# EAGLE design Shruti-FrontPanel-v01 (EAGLE 5.06)
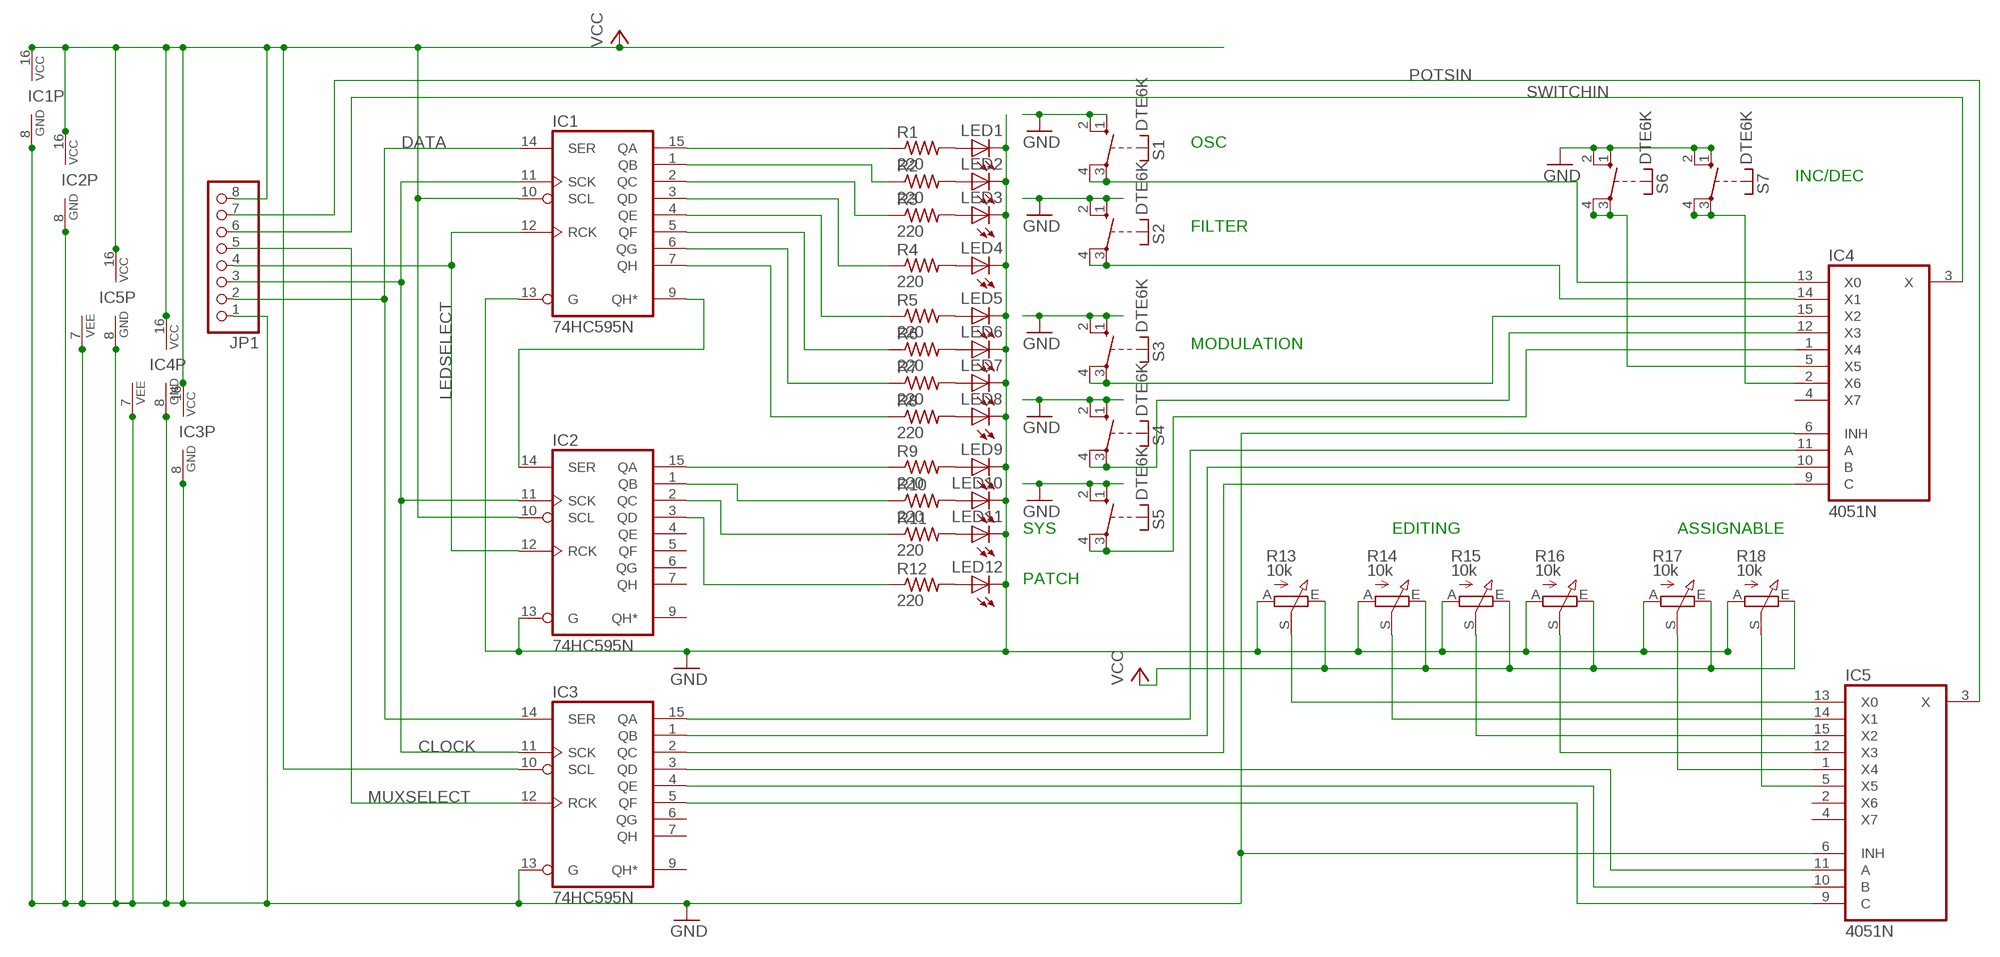
[diagram p0: schematic, sheet 1]

## Parts
IC1  74HC595N  [DIL16]
IC2  74HC595N  [DIL16]
IC3  74HC595N  [DIL16]
IC4  4051N  [DIL16]
IC5  4051N  [DIL16]
JP1  PINHD-1X8  [1X08]
LED1  LED3MM  [LED3MM]
LED2  LED3MM  [LED3MM]
LED3  LED3MM  [LED3MM]
LED4  LED3MM  [LED3MM]
LED5  LED3MM  [LED3MM]
LED6  LED3MM  [LED3MM]
LED7  LED3MM  [LED3MM]
LED8  LED3MM  [LED3MM]
LED9  LED3MM  [LED3MM]
LED10  LED3MM  [LED3MM]
LED11  LED3MM  [LED3MM]
LED12  LED3MM  [LED3MM]
R1  220  R-US_0309/12  [0309/12]
R2  220  R-US_0309/12  [0309/12]
R3  220  R-US_0309/12  [0309/12]
R4  220  R-US_0309/12  [0309/12]
R5  220  R-US_0309/12  [0309/12]
R6  220  R-US_0309/12  [0309/12]
R7  220  R-US_0309/12  [0309/12]
R8  220  R-US_0309/12  [0309/12]
R9  220  R-US_0309/12  [0309/12]
R10  220  R-US_0309/12  [0309/12]
R11  220  R-US_0309/12  [0309/12]
R12  220  R-US_0309/12  [0309/12]
R13  10k  POT_EUCABLED  [CABLE_POT_6MM]
R14  10k  POT_EUCABLED  [CABLE_POT_6MM]
R15  10k  POT_EUCABLED  [CABLE_POT_6MM]
R16  10k  POT_EUCABLED  [CABLE_POT_6MM]
R17  10k  POT_EUCABLED  [CABLE_POT_6MM]
R18  10k  POT_EUCABLED  [CABLE_POT_6MM]
S1  DTE6K  [DTE6K]
S2  DTE6K  [DTE6K]
S3  DTE6K  [DTE6K]
S4  DTE6K  [DTE6K]
S5  DTE6K  [DTE6K]
S6  DTE6K  [DTE6K]
S7  DTE6K  [DTE6K]

## Nets
CLOCK: IC1.11(SCK) IC2.11(SCK) IC3.11(SCK) JP1.3
DATA: IC1.14(SER) IC3.14(SER) JP1.2
GND: IC1.8(GND) IC1.13(G) IC2.8(GND) IC2.13(G) IC3.8(GND) IC3.13(G) IC4.6(INH) IC4.7(VEE) IC4.8(GND) IC5.6(INH) IC5.7(VEE) IC5.8(GND) JP1.1 LED1.K(C) LED2.K(C) LED3.K(C) LED4.K(C) LED5.K(C) LED6.K(C) LED7.K(C) LED8.K(C) LED9.K(C) LED10.K(C) LED11.K(C) LED12.K(C) R13.A R14.A R15.A R16.A R17.A R18.A S1.1(S) S1.2(S) S2.1(S) S2.2(S) S3.1(S) S3.2(S) S4.1(S) S4.2(S) S5.1(S) S5.2(S) S6.1(S) S6.2(S) S7.1(S) S7.2(S)
LEDSELECT: IC1.12(RCK) IC2.12(RCK) JP1.4
MUXSELECT: IC3.12(RCK) JP1.5
N$1: IC1.9(QH*) IC2.14(SER)
N$2: LED1.A R1.2
N$3: LED2.A R2.2
N$4: LED3.A R3.2
N$5: LED4.A R4.2
N$6: LED5.A R5.2
N$7: LED6.A R6.2
N$8: LED7.A R7.2
N$9: LED9.A R9.2
N$10: LED10.A R10.2
N$11: LED11.A R11.2
N$12: LED12.A R12.2
N$13: IC1.15(QA) R1.1
N$14: IC1.1(QB) R2.1
N$15: IC1.2(QC) R3.1
N$16: IC1.3(QD) R4.1
N$17: IC1.4(QE) R5.1
N$18: IC1.5(QF) R6.1
N$19: IC1.6(QG) R7.1
N$20: IC1.7(QH) R8.1
N$21: LED8.A R8.2
N$22: IC2.15(QA) R9.1
N$23: IC2.1(QB) R10.1
N$24: IC2.2(QC) R11.1
N$25: IC3.15(QA) IC4.11(A)
N$26: IC3.1(QB) IC4.10(B)
N$27: IC2.3(QD) R12.1
N$28: IC5.1(X4) R17.S
N$29: IC5.5(X5) R18.S
N$31: IC3.2(QC) IC4.9(C)
N$32: IC3.3(QD) IC5.11(A)
N$33: IC3.4(QE) IC5.10(B)
N$34: IC3.5(QF) IC5.9(C)
N$35: IC5.13(X0) R13.S
N$36: IC4.5(X5) S6.3(P) S6.4(P)
N$37: IC5.14(X1) R14.S
N$38: IC5.15(X2) R15.S
N$39: IC5.12(X3) R16.S
N$40: IC4.2(X6) S7.3(P) S7.4(P)
N$41: IC4.13(X0) S1.3(P) S1.4(P)
N$42: IC4.14(X1) S2.3(P) S2.4(P)
N$43: IC4.15(X2) S3.3(P) S3.4(P)
N$44: IC4.12(X3) S4.3(P) S4.4(P)
N$45: IC4.1(X4) S5.3(P) S5.4(P)
POTSIN: IC5.3(X) JP1.7
SWITCHIN: IC4.3(X) JP1.6
VCC: IC1.10(SCL) IC1.16(VCC) IC2.10(SCL) IC2.16(VCC) IC3.10(SCL) IC3.16(VCC) IC4.16(VCC) IC5.16(VCC) JP1.8 R13.E R14.E R15.E R16.E R17.E R18.E
Unconnected: IC2.4(QE) IC2.5(QF) IC2.6(QG) IC2.7(QH) IC2.9(QH*) IC3.6(QG) IC3.7(QH) IC3.9(QH*) IC4.4(X7) IC5.2(X6) IC5.4(X7)

## Notes on the sheet
- OSC
- INC/DEC
- FILTER
- MODULATION
- SYS | EDITING | ASSIGNABLE
- PATCH

## Library data of the parts
IC1-IC3 = 74xx-eu:74*595: 8-bit SHIFT REGISTER, output latch
IC4 IC5 = 40xx:4051: 8-channel ANALOG MULTIPLEXER
JP1 = pinhead:PINHD-1X8: PIN HEADER
LED1-LED12 = led:LED: LED OSRAM: - CHIPLED LG R971, LG N971, LY N971, LG Q971, LY Q971, LO R971, LY R971 LH N974, LH R974 LS Q976, LO Q976, LY Q976 LO Q996 - Hyper CHIPLED LW Q18S LB Q993, LB Q99A, LB R99A - SideLED LS A670, LO A670, LY A670, LG A670, LP A670 LB A673, LV A673, LT A673, LW A673 LH A674 LY A675 LS A676, LA A676, LO A676, LY A676, LW A676 LS A679, LY A679, LG A679 - Hyper Micro SIDELED® LS Y876, LA Y876, LO Y876, LY Y876 LT Y87S - SmartLED LW L88C, LW L88S LB L89C, LB L89S, LG L890 LS L89K, LO L89K, LY L89K LS L896, LA L896, LO L896, LY L896 - TOPLED LS T670, LO T670, LY T670, LG T670, LP T670 LSG T670, LSP T670, LSY T670, LOP T670, LYG T670 LG T671, LOG T671, LSG T671 LB T673, LV T673, LT T673, LW T673 LH T674 LS T676, LA T676, LO T676, LY T676, LB T676, LH T676, LSB T676, LW T676 LB T67C, LV T67C, LT T67C, LS T67K, LO T67K, LY T67K, LW E67C LS E67B, LA E67B, LO E67B, LY E67B, LB E67C, LV E67C, LT E67C LW T67C LS T679, LY T679, LG T679 LS T770, LO T770, LY T770, LG T770, LP T770 LB T773, LV T773, LT T773, LW T773 LH T774 LS E675, LA E675, LY E675, LS T675 LS T776, LA T776, LO T776, LY T776, LB T776 LHGB T686 LT T68C, LB T68C - Hyper Mini TOPLED® LB M676 - Mini TOPLED Santana® LG M470 LS M47K, LO M47K, LY M47K Source: http://www.osram.convergy.de LUXEON: - LUMILED® LXK2-PW12-R00, LXK2-PW12-S00, LXK2-PW14-U00, LXK2-PW14-V00 LXK2-PM12-R00, LXK2-PM12-S00, LXK2-PM14-U00 LXK2-PE12-Q00, LXK2-PE12-R00, LXK2-PE12-S00, LXK2-PE14-T00, LXK2-PE14-U00 LXK2-PB12-K00, LXK2-PB12-L00, LXK2-PB12-M00, LXK2-PB14-N00, LXK2-PB14-P00, LXK2-PB14-Q00 LXK2-PR12-L00, LXK2-PR12-M00, LXK2-PR14-Q00, LXK2-PR14-R00 LXK2-PD12-Q00, LXK2-PD12-R00, LXK2-PD12-S00 LXK2-PH12-R00, LXK2-PH12-S00 LXK2-PL12-P00, LXK2-PL12-Q00, LXK2-PL12-R00 Source: www.luxeon.com KINGBRIGHT: KA-3528ASYC Source: www.kingbright.com
R1-R12 = resistor:R-US_: RESISTOR, American symbol
R13-R18 = pot-cable:POT_EU
S1-S7 = switch-misc:DT: ITT SWITCH

## Board
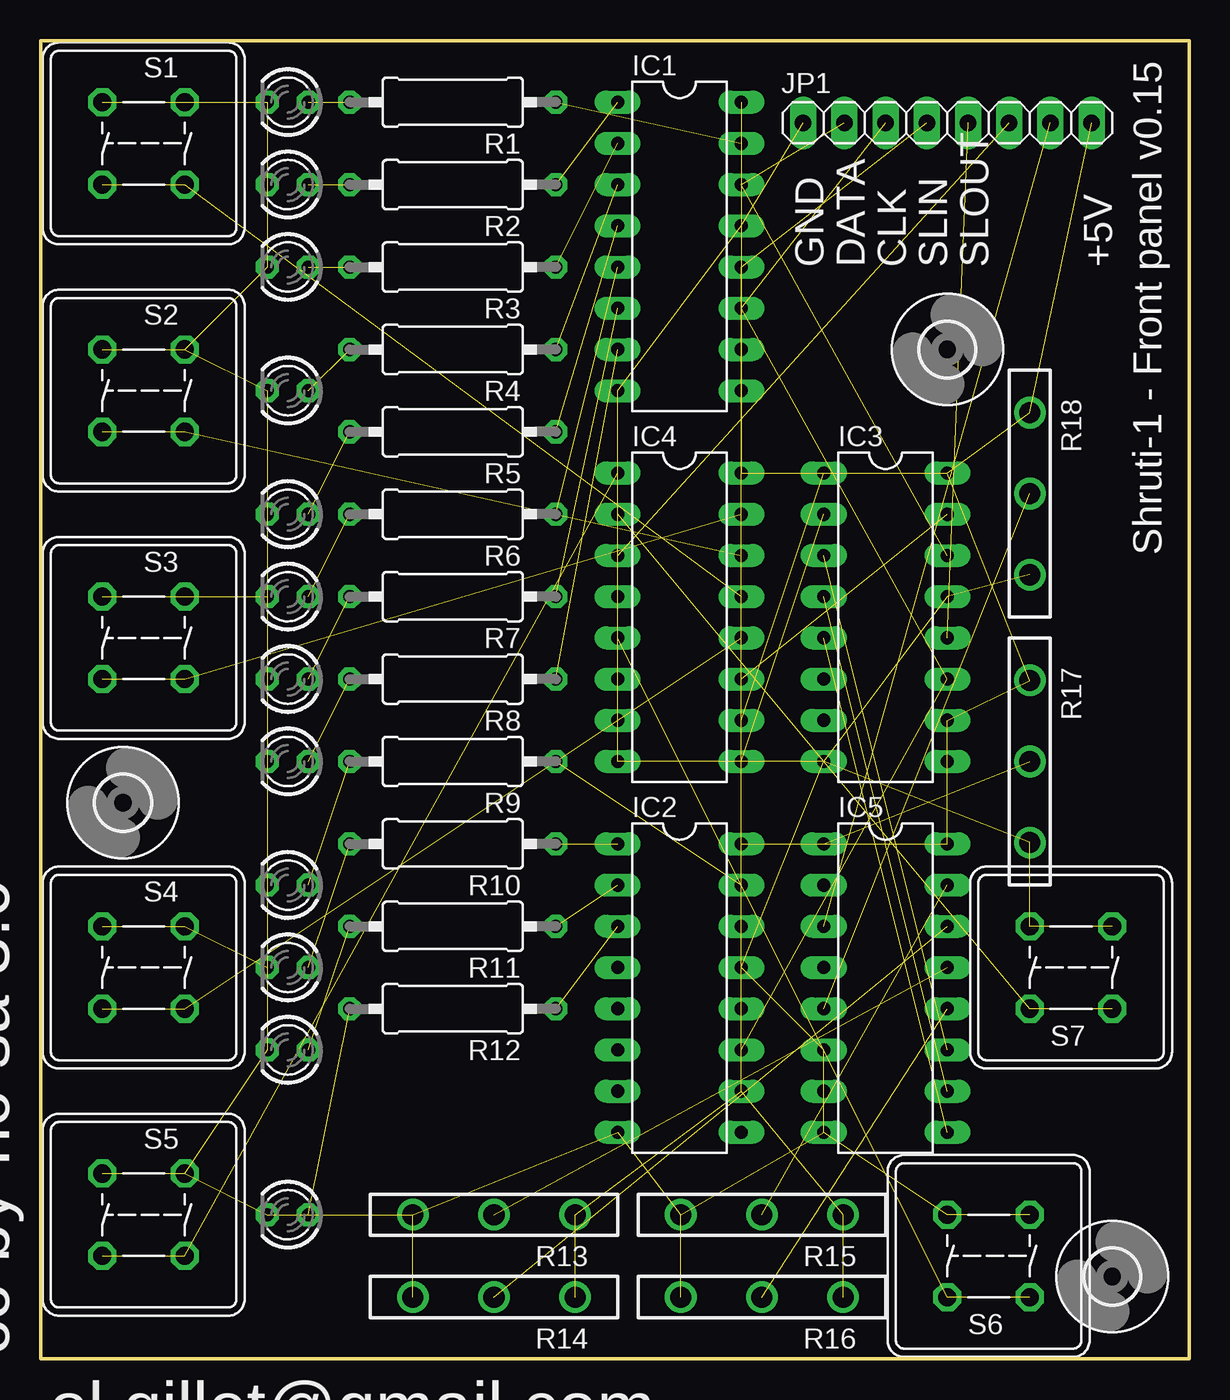
[diagram p1: board, top side]
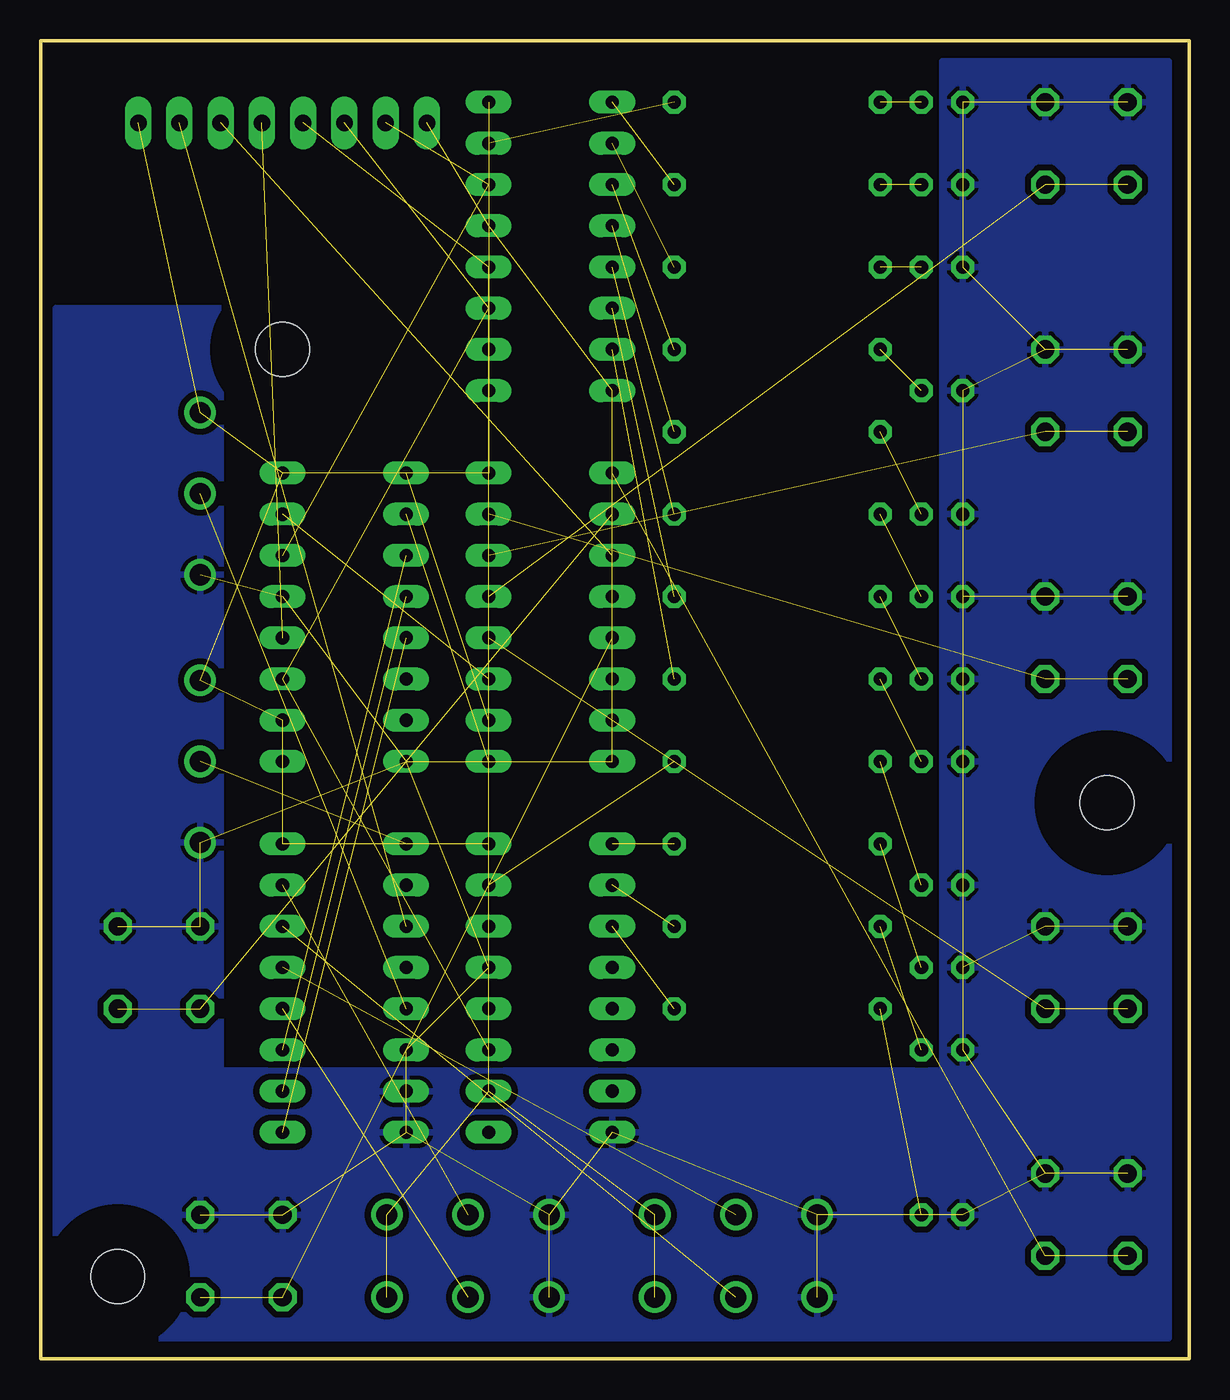
[diagram p2: board, bottom side, seen from below]

Size 70.79 x 81.27 mm. Coordinates in mm from the lower left corner, seen from the top.
Outline: 70.79,0 70.79,81.27 0,81.27 0,0 70.79,0
Copper layers (1*16): Top 0.035mm / dielectric 1.5mm / Bottom 0.035mm
Design rules "SparkFun_10mil *": minimum track width 10mil, minimum drill 20mil, track to track 10mil, track to pad 10mil, pad to pad 10mil, via to via 10mil, smd to smd 10mil, copper to edge 10mil, drill to drill 10mil, minimum pad ring 12mil, minimum via ring 10mil, stop-mask expansion 4mil, vias tented up to drill 25mil, thermal gap 10mil

### Footprints (pad centres in the part's own frame; a part is rotated, then mirrored left to right if it is on the bottom)
DIL16 = drill 0.813 long: 1 -8.89,-3.81; 2 -6.35,-3.81; 3 -3.81,-3.81; 4 -1.27,-3.81; 5 1.27,-3.81; 6 3.81,-3.81; 7 6.35,-3.81; 8 8.89,-3.81; 9 8.89,3.81; 10 6.35,3.81; 11 3.81,3.81; 12 1.27,3.81; 13 -1.27,3.81; 14 -3.81,3.81; 15 -6.35,3.81; 16 -8.89,3.81
1X08 = drill 1.016 long: 1 -8.89,0; 2 -6.35,0; 3 -3.81,0; 4 -1.27,0; 5 1.27,0; 6 3.81,0; 7 6.35,0; 8 8.89,0
LED3MM = drill 0.813 octagon: A -1.27,0; K 1.27,0
0309/12 = drill 0.813 octagon: 1 -6.35,0; 2 6.35,0
CABLE_POT_6MM = drill 1.3 pad 1.93 round: A -5,0; E 5,0; S 0,0
DTE6K = drill 1.118 octagon: 1 -2.54,2.54; 2 2.54,2.54; 3 2.54,-2.54; 4 -2.54,-2.54
3,3 = hole 3.3: 0,0

### Placement (x,y rotation side)
IC1  39.37,68.58 270 top
IC2  39.37,22.86 270 top
IC3  52.07,45.72 270 top
IC4  39.37,45.72 270 top
IC5  52.07,22.86 270 top
JP1  55.88,76.2 0 top
LED1  15.24,77.47 180 top
LED2  15.24,72.39 180 top
LED3  15.24,67.31 180 top
LED4  15.24,59.69 180 top
LED5  15.24,52.07 180 top
LED6  15.24,46.99 180 top
LED7  15.24,41.91 180 top
LED8  15.24,36.83 180 top
LED9  15.24,29.21 180 top
LED10  15.24,24.13 180 top
LED11  15.24,19.05 180 top
LED12  15.24,8.89 180 top
R1  25.4,77.47 180 top
R2  25.4,72.39 180 top
R3  25.4,67.31 180 top
R4  25.4,62.23 180 top
R5  25.4,57.15 180 top
R6  25.4,52.07 180 top
R7  25.4,46.99 180 top
R8  25.4,41.91 180 top
R9  25.4,36.83 180 top
R10  25.4,31.75 180 top
R11  25.4,26.67 180 top
R12  25.4,21.59 180 top
R13  27.94,8.89 0 top
R14  27.94,3.81 0 top
R15  44.45,8.89 0 top
R16  44.45,3.81 0 top
R17  60.96,36.83 90 top
R18  60.96,53.34 90 top
S1  6.35,74.93 0 top
S2  6.35,59.69 0 top
S3  6.35,44.45 0 top
S4  6.35,24.13 0 top
S5  6.35,8.89 0 top
S6  58.42,6.35 0 top
S7  63.5,24.13 0 top
U$1  [3,3]  5.08,34.29 0 top
U$2  [3,3]  66.04,5.08 0 top
U$3  [3,3]  55.88,62.23 0 top

### Tracks (layer width: path | path; a pad name or v marks a point on that pad's centre or on a via)
CLOCK  (3 unrouted)
DATA  (2 unrouted)
GND  (44 unrouted)
  pour Bottom (isolate 0.381): 1.27,80.01 1.27,1.27 69.85,1.27 69.85,64.77 59.69,64.77 59.69,17.78 15.24,17.78 15.24,80.01
LEDSELECT  (2 unrouted)
MUXSELECT  (1 unrouted)
N$1  (1 unrouted)
N$2  (1 unrouted)
N$3  (1 unrouted)
N$4  (1 unrouted)
N$5  (1 unrouted)
N$6  (1 unrouted)
N$7  (1 unrouted)
N$8  (1 unrouted)
N$9  (1 unrouted)
N$10  (1 unrouted)
N$11  (1 unrouted)
N$12  (1 unrouted)
N$13  (1 unrouted)
N$14  (1 unrouted)
N$15  (1 unrouted)
N$16  (1 unrouted)
N$17  (1 unrouted)
N$18  (1 unrouted)
N$19  (1 unrouted)
N$20  (1 unrouted)
N$21  (1 unrouted)
N$22  (1 unrouted)
N$23  (1 unrouted)
N$24  (1 unrouted)
N$25  (1 unrouted)
N$26  (1 unrouted)
N$27  (1 unrouted)
N$28  (1 unrouted)
N$29  (1 unrouted)
N$31  (1 unrouted)
N$32  (1 unrouted)
N$33  (1 unrouted)
N$34  (1 unrouted)
N$35  (1 unrouted)
N$36  (2 unrouted)
N$37  (1 unrouted)
N$38  (1 unrouted)
N$39  (1 unrouted)
N$40  (2 unrouted)
N$41  (2 unrouted)
N$42  (2 unrouted)
N$43  (2 unrouted)
N$44  (2 unrouted)
N$45  (2 unrouted)
POTSIN  (1 unrouted)
SWITCHIN  (1 unrouted)
VCC  (14 unrouted)

### Text on the board
tPlace: Shruti-1 - Front panel v0.15 | GND | DATA | CLK | SLIN | SLOUT | +5V
tNames: cc-by-nc-sa 3.0 | ol.gillet@gmail.com